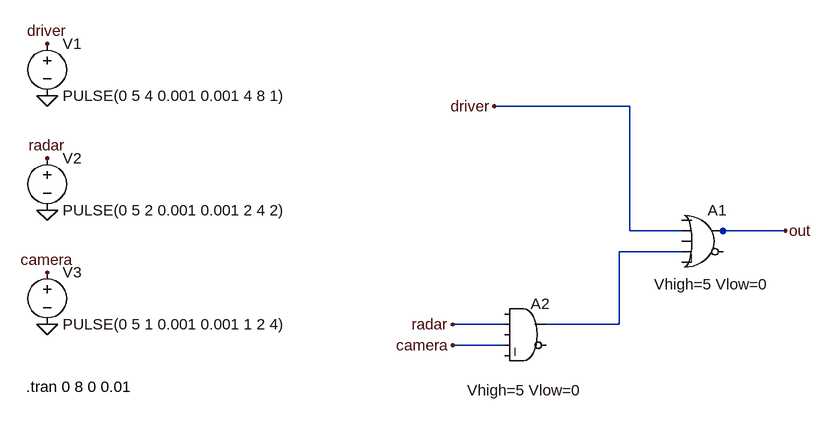
[diagram p0: schematic L2-CarBreak.asc]
L2-CarBreak.asc, the LTspice schematic file:
Version 4
SHEET 1 880 680
WIRE 160 -32 -48 -32
WIRE 160 160 160 -32
WIRE 240 160 160 160
WIRE 304 160 288 160
WIRE 400 160 304 160
WIRE 240 192 144 192
WIRE -32 304 -112 304
WIRE 144 304 144 192
WIRE 144 304 32 304
WIRE -32 336 -112 336
FLAG 400 160 out
FLAG -736 -128 driver
FLAG -736 48 radar
FLAG -736 224 camera
FLAG -736 -48 0
FLAG -736 128 0
FLAG -736 304 0
FLAG -48 -32 driver
FLAG -112 304 radar
FLAG -112 336 camera
SYMBOL Digital\\or 272 112 R0
WINDOW 39 -74 130 Left 2
SYMATTR SpiceLine Vhigh=5 Vlow=0
SYMATTR InstName A1
SYMBOL voltage -736 -144 R0
WINDOW 123 0 0 Left 0
WINDOW 39 0 0 Left 0
SYMATTR InstName V1
SYMATTR Value PULSE(0 5 4 0.001 0.001 4 8 1)
SYMBOL voltage -736 32 R0
WINDOW 123 0 0 Left 0
WINDOW 39 0 0 Left 0
SYMATTR InstName V2
SYMATTR Value PULSE(0 5 2 0.001 0.001 2 4 2)
SYMBOL Digital\\and 0 256 R0
WINDOW 39 -90 149 Left 2
SYMATTR SpiceLine Vhigh=5 Vlow=0
SYMATTR InstName A2
SYMBOL voltage -736 208 R0
WINDOW 123 0 0 Left 0
WINDOW 39 0 0 Left 0
SYMATTR InstName V3
SYMATTR Value PULSE(0 5 1 0.001 0.001 1 2 4)
TEXT -768 400 Left 2 !.tran 0 8 0 0.01

The netlist it stands for:
* L2-CarBreak.asc
A1 0 driver 0 N001 0 0 out 0 OR Vhigh=5 Vlow=0
V1 driver 0 PULSE(0 5 4 0.001 0.001 4 8 1)
V2 radar 0 PULSE(0 5 2 0.001 0.001 2 4 2)
A2 0 radar 0 camera 0 0 N001 0 AND Vhigh=5 Vlow=0
V3 camera 0 PULSE(0 5 1 0.001 0.001 1 2 4)
.tran 0 8 0 0.01
.backanno
.end